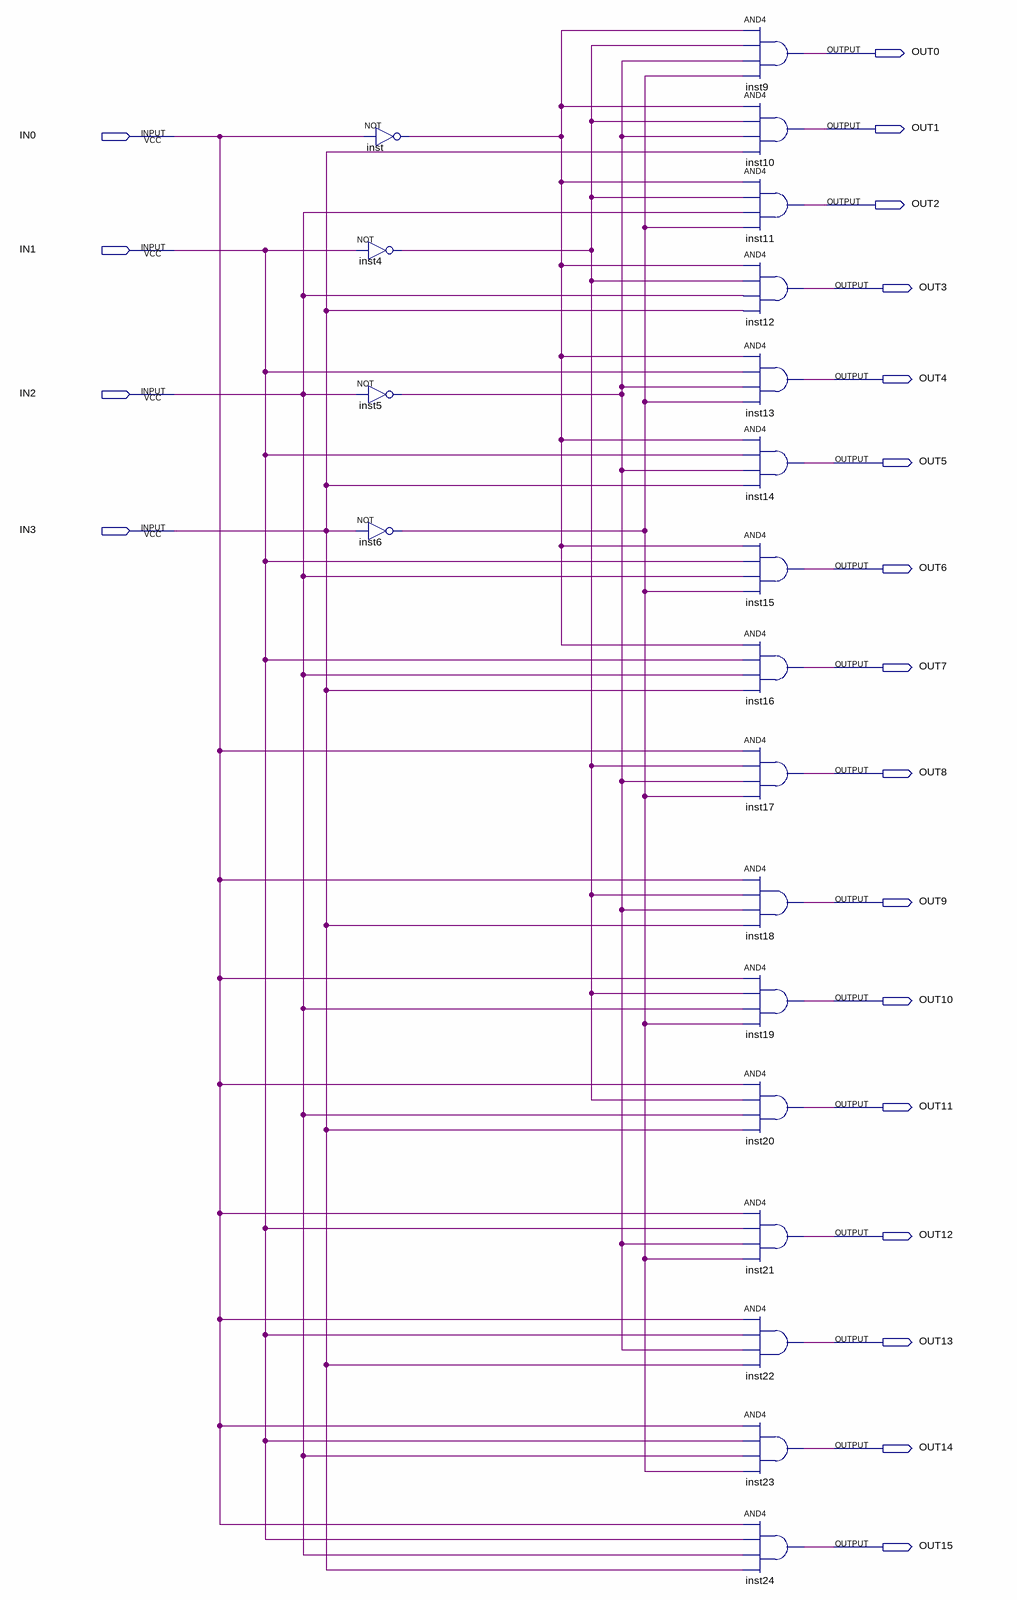
[diagram p0: schematic sheet]
// Quartus schematic DECODER.bdf as structural Verilog: 20 symbols, 20 pins
module DECODER (
  input  IN0,
  input  IN1,
  input  IN2,
  input  IN3,
  output OUT0,
  output OUT1,
  output OUT2,
  output OUT3,
  output OUT4,
  output OUT5,
  output OUT6,
  output OUT7,
  output OUT8,
  output OUT9,
  output OUT10,
  output OUT11,
  output OUT12,
  output OUT13,
  output OUT14,
  output OUT15
);

  wire inst4_out, inst5_out, inst6_out, inst_out;

  not inst (inst_out, IN0);
  not inst4 (inst4_out, IN1);
  not inst5 (inst5_out, IN2);
  not inst6 (inst6_out, IN3);
  and inst9 (OUT0, inst_out, inst4_out, inst5_out, inst6_out);
  and inst10 (OUT1, inst_out, inst4_out, inst5_out, IN3);
  and inst11 (OUT2, inst_out, inst4_out, IN2, inst6_out);
  and inst12 (OUT3, inst_out, inst4_out, IN2, IN3);
  and inst13 (OUT4, inst_out, IN1, inst5_out, inst6_out);
  and inst14 (OUT5, inst_out, IN1, inst5_out, IN3);
  and inst15 (OUT6, inst_out, IN1, IN2, inst6_out);
  and inst16 (OUT7, inst_out, IN1, IN2, IN3);
  and inst17 (OUT8, IN0, inst4_out, inst5_out, inst6_out);
  and inst18 (OUT9, IN0, inst4_out, inst5_out, IN3);
  and inst19 (OUT10, IN0, inst4_out, IN2, inst6_out);
  and inst20 (OUT11, IN0, inst4_out, IN2, IN3);
  and inst21 (OUT12, IN0, IN1, inst5_out, inst6_out);
  and inst22 (OUT13, IN0, IN1, inst5_out, IN3);
  and inst23 (OUT14, IN0, IN1, IN2, inst6_out);
  and inst24 (OUT15, IN0, IN1, IN2, IN3);
endmodule
